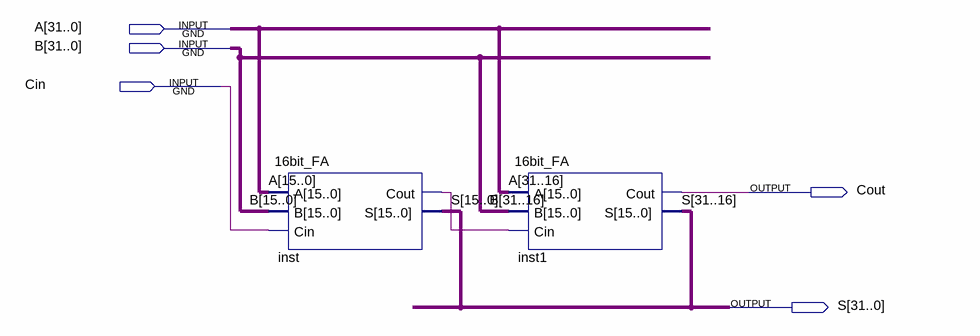
[diagram p0: schematic sheet]
// Quartus schematic 32bit_FA.bdf as structural Verilog: 2 symbols, 5 pins
module \32bit_FA  (
  input  [31:0] A,
  input  [31:0] B,
  input  Cin,
  output Cout,
  output [31:0] S
);

  wire inst_cout;

  \16bit_FA  inst (.A(A[15:0]), .B(B[15:0]), .Cin(Cin), .Cout(inst_cout), .S(S[15:0]));
  \16bit_FA  inst1 (.A(A[31:16]), .B(B[31:16]), .Cin(inst_cout), .Cout(Cout), .S(S[31:16]));
endmodule
